# Altium schematic sheet 07 Audio SPK.SchDoc: CM4 IO
size 297 x 209 mm; Page Create Date: March  8, 1995; Page Number: 7; Page Size: A4; Comment: radxa_1010; Page Count: 19; RevCode: V1.10; Doc: 07 Audio SPK; DsnPath: D:\WMS\黄工\[RC126]CM4_IO_V1.10\[RC126]_V1.10\CM4 IO_V1.10.DSN; SchematicName: CM4 IO V1.10; PageName: 07 Audio SPK; PageSize: A4; TopSchematic: True
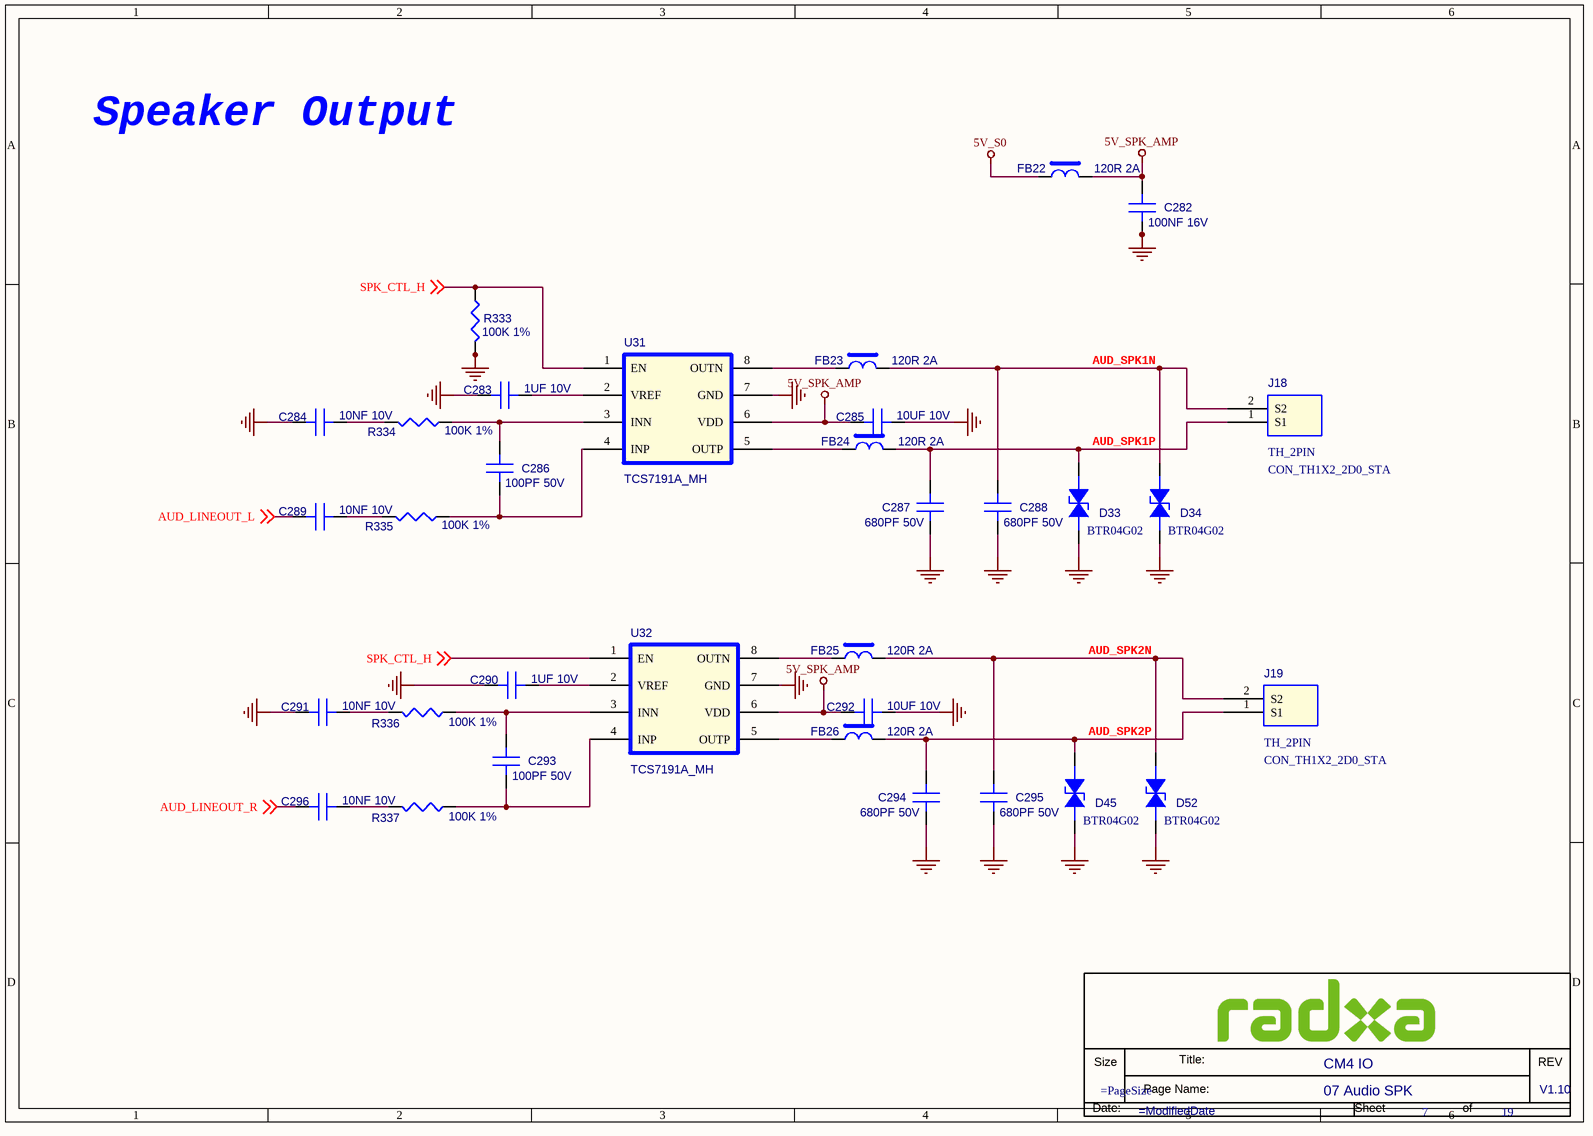
[diagram p0: 07 Audio SPK.SchDoc]

## Parts
*  Doc: 07 Audio SPK  RevCode: V1.10  Title: CM4 IO  Page Number: 7  Page Count: 19  (hidden comment: radxa_1010)  (graphical)
C282  100NF 16V  [C0201]
C283  1UF 10V  [C0201]
C284  10NF 10V  [C0201]
C285  10UF 10V  [C0603]
C286  100PF 50V  [C0201]
C287  680PF 50V  [C0201]
C288  680PF 50V  [C0201]
C289  10NF 10V  [C0201]
C290  1UF 10V  [C0201]
C291  10NF 10V  [C0201]
C292  10UF 10V  [C0603]
C293  100PF 50V  [C0201]
C294  680PF 50V  [C0201]
C295  680PF 50V  [C0201]
C296  10NF 10V  [C0201]
D33  BTR04G02  [DFN1006-2L]
D34  BTR04G02  [DFN1006-2L]
D45  BTR04G02  [DFN1006-2L]
D52  BTR04G02  [DFN1006-2L]
FB22  120R 2A  [FB0402]
FB23  120R 2A  [FB0402]
FB24  120R 2A  [FB0402]
FB25  120R 2A  [FB0402]
FB26  120R 2A  [FB0402]
J18  TH_2PIN  PCB Footprint: CON_TH1X2_2D0_STA  [CON_TH1X2_2D54_STA]
J19  TH_2PIN  PCB Footprint: CON_TH1X2_2D0_STA  [CON_TH1X2_2D54_STA]
R333  100K 1%  [R0402]
R334  100K 1%  [R0402]
R335  100K 1%  [R0402]
R336  100K 1%  [R0402]
R337  100K 1%  [R0402]
U31  TCS7191A_MH  [MSOP8_0D65_5D0]
U32  TCS7191A_MH  [MSOP8_0D65_5D0]

## Nets
5V_S0: FB22.1
5V_SPK_AMP: C282.1(A) C285.1(A) C292.1(A) FB22.2 U31.6(VDD) U32.6(VDD)
GND: C282.2(B) C283.1(A) C284.1(A) C285.2(B) C287.2(B) C288.2(B) C290.1(A) C291.1(A) C292.2(B) C294.2(B) C295.2(B) D33.1(ANODE) D34.1(ANODE) D45.1(ANODE) D52.1(ANODE) R333.2 U31.7(GND) U32.7(GND)
AUD_LINEOUT_L: C289.1(A) ; off-sheet AUD_LINEOUT_L
AUD_LINEOUT_R: C296.1(A) ; off-sheet AUD_LINEOUT_R
AUD_SPK1N: C288.1(A) D34.2(CATHODE) FB23.2 J18.2(S2)
AUD_SPK1P: C287.1(A) D33.2(CATHODE) FB24.2 J18.1(S1)
AUD_SPK2N: C295.1(A) D52.2(CATHODE) FB25.2 J19.2(S2)
AUD_SPK2P: C294.1(A) D45.2(CATHODE) FB26.2 J19.1(S1)
SPK_CTL_H: R333.1 U31.1(EN) U32.1(EN) ; off-sheet SPK_CTL_H
NetC283_2: C283.2(B) U31.2(VREF)
NetC284_2: C284.2(B) R334.1
NetC286_1: C286.1(A) R334.2 U31.3(INN)
NetC286_2: C286.2(B) R335.2 U31.4(INP)
NetC289_2: C289.2(B) R335.1
NetC290_2: C290.2(B) U32.2(VREF)
NetC291_2: C291.2(B) R336.1
NetC293_1: C293.1(A) R336.2 U32.3(INN)
NetC293_2: C293.2(B) R337.2 U32.4(INP)
NetC296_2: C296.2(B) R337.1
NetFB23_1: FB23.1 U31.8(OUTN)
NetFB24_1: FB24.1 U31.5(OUTP)
NetFB25_1: FB25.1 U32.8(OUTN)
NetFB26_1: FB26.1 U32.5(OUTP)

## Notes on the sheet
- Speaker Output
- (in symbol radxa_1010) Size; Title:; REV; Page Name:; Date:; Sheet; of

## Library data of the parts
C282 = C: SMD  0201  100NF  16V  X5R  ±20%  ROHS; PARTS: 1; Part Reference: C282; Part Number: A1C01.00099; OriginalSymbolOrigin: (0,30); PKG_TYPE: CAP2-100-250; LEVEL: STD; PINSWAP: (A,B); Preferred: 6715f349cd0bc5; Value: 100NF 16V; Part Type: 陶瓷电容
C283 = C: SMD  0201  1UF  10V  X5R  ±20%  ROHS; PARTS: 1; Part Reference: C283; Part Number: A1C01.00081; OriginalSymbolOrigin: (0,30); PKG_TYPE: CAP2-100-250; LEVEL: STD; PINSWAP: (A,B); Value: 1UF 10V; Part Type: 陶瓷电容; PCB Footprint: C0201
C284 = C: SMD  0201  10NF  10V  X5R  ±20%  ROHS; PARTS: 1; Part Reference: C284; Part Number: A1C01.00095; OriginalSymbolOrigin: (0,30); PKG_TYPE: CAP2-100-250; LEVEL: STD; PINSWAP: (A,B); Value: 10NF 10V; Part Type: 陶瓷电容; PCB Footprint: C0201
C285 = C: SMD  0603  10UF  10V  X5R  ±20%  ROHS; PARTS: 1; Part Reference: C285; Part Number: A1C01.00075; OriginalSymbolOrigin: (0,30); PKG_TYPE: CAP2-100-250; LEVEL: STD; PINSWAP: (A,B); Value: 10UF 10V; Part Type: 陶瓷电容; PCB Footprint: C0603
C286 = C: SMD  0201  100PF  50V  NPO  ±5%  ROHS; PARTS: 1; Part Reference: C286; Part Number: A1C01.00382; OriginalSymbolOrigin: (0,30); PKG_TYPE: CAP2-100-250; LEVEL: STD; PINSWAP: (A,B); Value: 100PF 50V; Part Type: 陶瓷电容; PCB Footprint: C0201
C287 = C: SMD  0201  680PF  50V  X7R  ±10%  ROHS; PARTS: 1; Part Reference: C287; Part Number: A1C01.00071; OriginalSymbolOrigin: (0,30); PKG_TYPE: CAP2-100-250; LEVEL: STD; PINSWAP: (A,B); Value: 680PF 50V; Part Type: 陶瓷电容; PCB Footprint: C0201
C288 = C: SMD  0201  680PF  50V  X7R  ±10%  ROHS; PARTS: 1; Part Reference: C288; Part Number: A1C01.00071; OriginalSymbolOrigin: (0,30); PKG_TYPE: CAP2-100-250; LEVEL: STD; PINSWAP: (A,B); Value: 680PF 50V; Part Type: 陶瓷电容; PCB Footprint: C0201
C289 = C: SMD  0201  10NF  10V  X5R  ±20%  ROHS; PARTS: 1; Part Reference: C289; Part Number: A1C01.00095; OriginalSymbolOrigin: (0,30); PKG_TYPE: CAP2-100-250; LEVEL: STD; PINSWAP: (A,B); Value: 10NF 10V; Part Type: 陶瓷电容; PCB Footprint: C0201
C290 = C: SMD  0201  1UF  10V  X5R  ±20%  ROHS; PARTS: 1; Part Reference: C290; Part Number: A1C01.00081; OriginalSymbolOrigin: (0,30); PKG_TYPE: CAP2-100-250; LEVEL: STD; PINSWAP: (A,B); Value: 1UF 10V; Part Type: 陶瓷电容; PCB Footprint: C0201
C291 = C: SMD  0201  10NF  10V  X5R  ±20%  ROHS; PARTS: 1; Part Reference: C291; Part Number: A1C01.00095; OriginalSymbolOrigin: (0,30); PKG_TYPE: CAP2-100-250; LEVEL: STD; PINSWAP: (A,B); Value: 10NF 10V; Part Type: 陶瓷电容; PCB Footprint: C0201
C292 = C: SMD  0603  10UF  10V  X5R  ±20%  ROHS; PARTS: 1; Part Reference: C292; Part Number: A1C01.00075; OriginalSymbolOrigin: (0,30); PKG_TYPE: CAP2-100-250; LEVEL: STD; PINSWAP: (A,B); Value: 10UF 10V; Part Type: 陶瓷电容; PCB Footprint: C0603
C293 = C: SMD  0201  100PF  50V  NPO  ±5%  ROHS; PARTS: 1; Part Reference: C293; Part Number: A1C01.00382; OriginalSymbolOrigin: (0,30); PKG_TYPE: CAP2-100-250; LEVEL: STD; PINSWAP: (A,B); Value: 100PF 50V; Part Type: 陶瓷电容; PCB Footprint: C0201
C294 = C: SMD  0201  680PF  50V  X7R  ±10%  ROHS; PARTS: 1; Part Reference: C294; Part Number: A1C01.00071; OriginalSymbolOrigin: (0,30); PKG_TYPE: CAP2-100-250; LEVEL: STD; PINSWAP: (A,B); Value: 680PF 50V; Part Type: 陶瓷电容; PCB Footprint: C0201
C295 = C: SMD  0201  680PF  50V  X7R  ±10%  ROHS; PARTS: 1; Part Reference: C295; Part Number: A1C01.00071; OriginalSymbolOrigin: (0,30); PKG_TYPE: CAP2-100-250; LEVEL: STD; PINSWAP: (A,B); Value: 680PF 50V; Part Type: 陶瓷电容; PCB Footprint: C0201
C296 = C: SMD  0201  10NF  10V  X5R  ±20%  ROHS; PARTS: 1; Part Reference: C296; Part Number: A1C01.00095; OriginalSymbolOrigin: (0,30); PKG_TYPE: CAP2-100-250; LEVEL: STD; PINSWAP: (A,B); Value: 10NF 10V; Part Type: 陶瓷电容; PCB Footprint: C0201
D33 = ESD: SMD  编带  0402  BTR04G02  B-tron  ROHS; Part Reference: D33; Part Number: A1D02.00002; Parameter: ESD-台舟 ESD5341N-封装 esd0402; ID: DE-E0004; Temp Coeff: -50℃ ~ +125℃; PCB Footprint: ESD_D0402; Value: BTR04G02; Part Type: 二极管-ESD管-桥堆-TVS管
D34 = ESD: SMD  编带  0402  BTR04G02  B-tron  ROHS; Part Reference: D34; Part Number: A1D02.00002; Parameter: ESD-台舟 ESD5341N-封装 esd0402; ID: DE-E0004; Temp Coeff: -50℃ ~ +125℃; PCB Footprint: ESD_D0402; Value: BTR04G02; Part Type: 二极管-ESD管-桥堆-TVS管
D45 = ESD: SMD  编带  0402  BTR04G02  B-tron  ROHS; Part Reference: D45; Part Number: A1D02.00002; Parameter: ESD-台舟 ESD5341N-封装 esd0402; ID: DE-E0004; Temp Coeff: -50℃ ~ +125℃; PCB Footprint: ESD_D0402; Value: BTR04G02; Part Type: 二极管-ESD管-桥堆-TVS管
D52 = ESD: SMD  编带  0402  BTR04G02  B-tron  ROHS; Part Reference: D52; Part Number: A1D02.00002; Parameter: ESD-台舟 ESD5341N-封装 esd0402; ID: DE-E0004; Temp Coeff: -50℃ ~ +125℃; PCB Footprint: ESD_D0402; Value: BTR04G02; Part Type: 二极管-ESD管-桥堆-TVS管
FB22 = BEAD: SMD  0402  FB120R  2A  ±25%  ROHS; Part Reference: FB22; Part Number: A1L09.00004; PCB Footprint: FB0402; Value: 120R 2A; Part Type: 贴片磁珠
FB23 = BEAD: SMD  0402  FB120R  2A  ±25%  ROHS; Part Reference: FB23; Part Number: A1L09.00004; PCB Footprint: FB0402; Value: 120R 2A; Part Type: 贴片磁珠
FB24 = BEAD: SMD  0402  FB120R  2A  ±25%  ROHS; Part Reference: FB24; Part Number: A1L09.00004; PCB Footprint: FB0402; Value: 120R 2A; Part Type: 贴片磁珠
FB25 = BEAD: SMD  0402  FB120R  2A  ±25%  ROHS; Part Reference: FB25; Part Number: A1L09.00004; PCB Footprint: FB0402; Value: 120R 2A; Part Type: 贴片磁珠
FB26 = BEAD: SMD  0402  FB120R  2A  ±25%  ROHS; Part Reference: FB26; Part Number: A1L09.00004; PCB Footprint: FB0402; Value: 120R 2A; Part Type: 贴片磁珠
J18 = TH_2PIN: DIP  排针座  1*2PIN  180度  2.0mm脚距  中间朔高2.0mm  针长一端3.9mm  另一端2.8mm  方针  黑色  ZX-PZ2.0-1-2PZZ  Megastar(兆星)  ROHS; Part Reference: J18; Part Number: A1J02.00089; Temp Coeff: -40℃ to +105℃; Preferred: 6715f352cd0bcd; Value: TH_2PIN; Part Type: 排座
J19 = TH_2PIN: DIP  排针座  1*2PIN  180度  2.0mm脚距  中间朔高2.0mm  针长一端3.9mm  另一端2.8mm  方针  黑色  ZX-PZ2.0-1-2PZZ  Megastar(兆星)  ROHS; Part Reference: J19; Part Number: A1J02.00089; Temp Coeff: -40℃ to +105℃; Preferred: 6715f352cd0bcd; Value: TH_2PIN; Part Type: 排座
R333 = R: SMD  0201  100K  1/20W  ±1%  ROHS; Part Reference: R333; Part Number: A1R01.00165; Preferred: 6715f349cd0bc5; Value: 100K 1%; Part Type: 贴片电阻
R334 = R: SMD  0201  100K  1/20W  ±1%  ROHS; Part Reference: R334; Part Number: A1R01.00165; Preferred: 6715f349cd0bc5; Value: 100K 1%; Part Type: 贴片电阻
R335 = R: SMD  0201  100K  1/20W  ±1%  ROHS; Part Reference: R335; Part Number: A1R01.00165; Preferred: 6715f349cd0bc5; Value: 100K 1%; Part Type: 贴片电阻
R336 = R: SMD  0201  100K  1/20W  ±1%  ROHS; Part Reference: R336; Part Number: A1R01.00165; Preferred: 6715f349cd0bc5; Value: 100K 1%; Part Type: 贴片电阻
R337 = R: SMD  0201  100K  1/20W  ±1%  ROHS; Part Reference: R337; Part Number: A1R01.00165; Preferred: 6715f349cd0bc5; Value: 100K 1%; Part Type: 贴片电阻
U31 = TCS7191A_MH: SMD  音频功率放大器  TCS7191A_MH  MSOP-8  TCS(汤诚)  ROHS; Part Reference: U31; Part Number: A1I01.00891; Preferred: 6715f349cd0bc5; Temp Coeff: -40℃ to +85℃; PCB Footprint: MSOP8_0D65_5D0; Value: TCS7191A_MH; Part Type: 集成电路/模块
U32 = TCS7191A_MH: SMD  音频功率放大器  TCS7191A_MH  MSOP-8  TCS(汤诚)  ROHS; Part Reference: U32; Part Number: A1I01.00891; Preferred: 6715f349cd0bc5; Temp Coeff: -40℃ to +85℃; PCB Footprint: MSOP8_0D65_5D0; Value: TCS7191A_MH; Part Type: 集成电路/模块
* = radxa_1010: Page Create Date: March  8, 1995; Page Size: =PageSize; Page Modify Date: =ModifiedDate